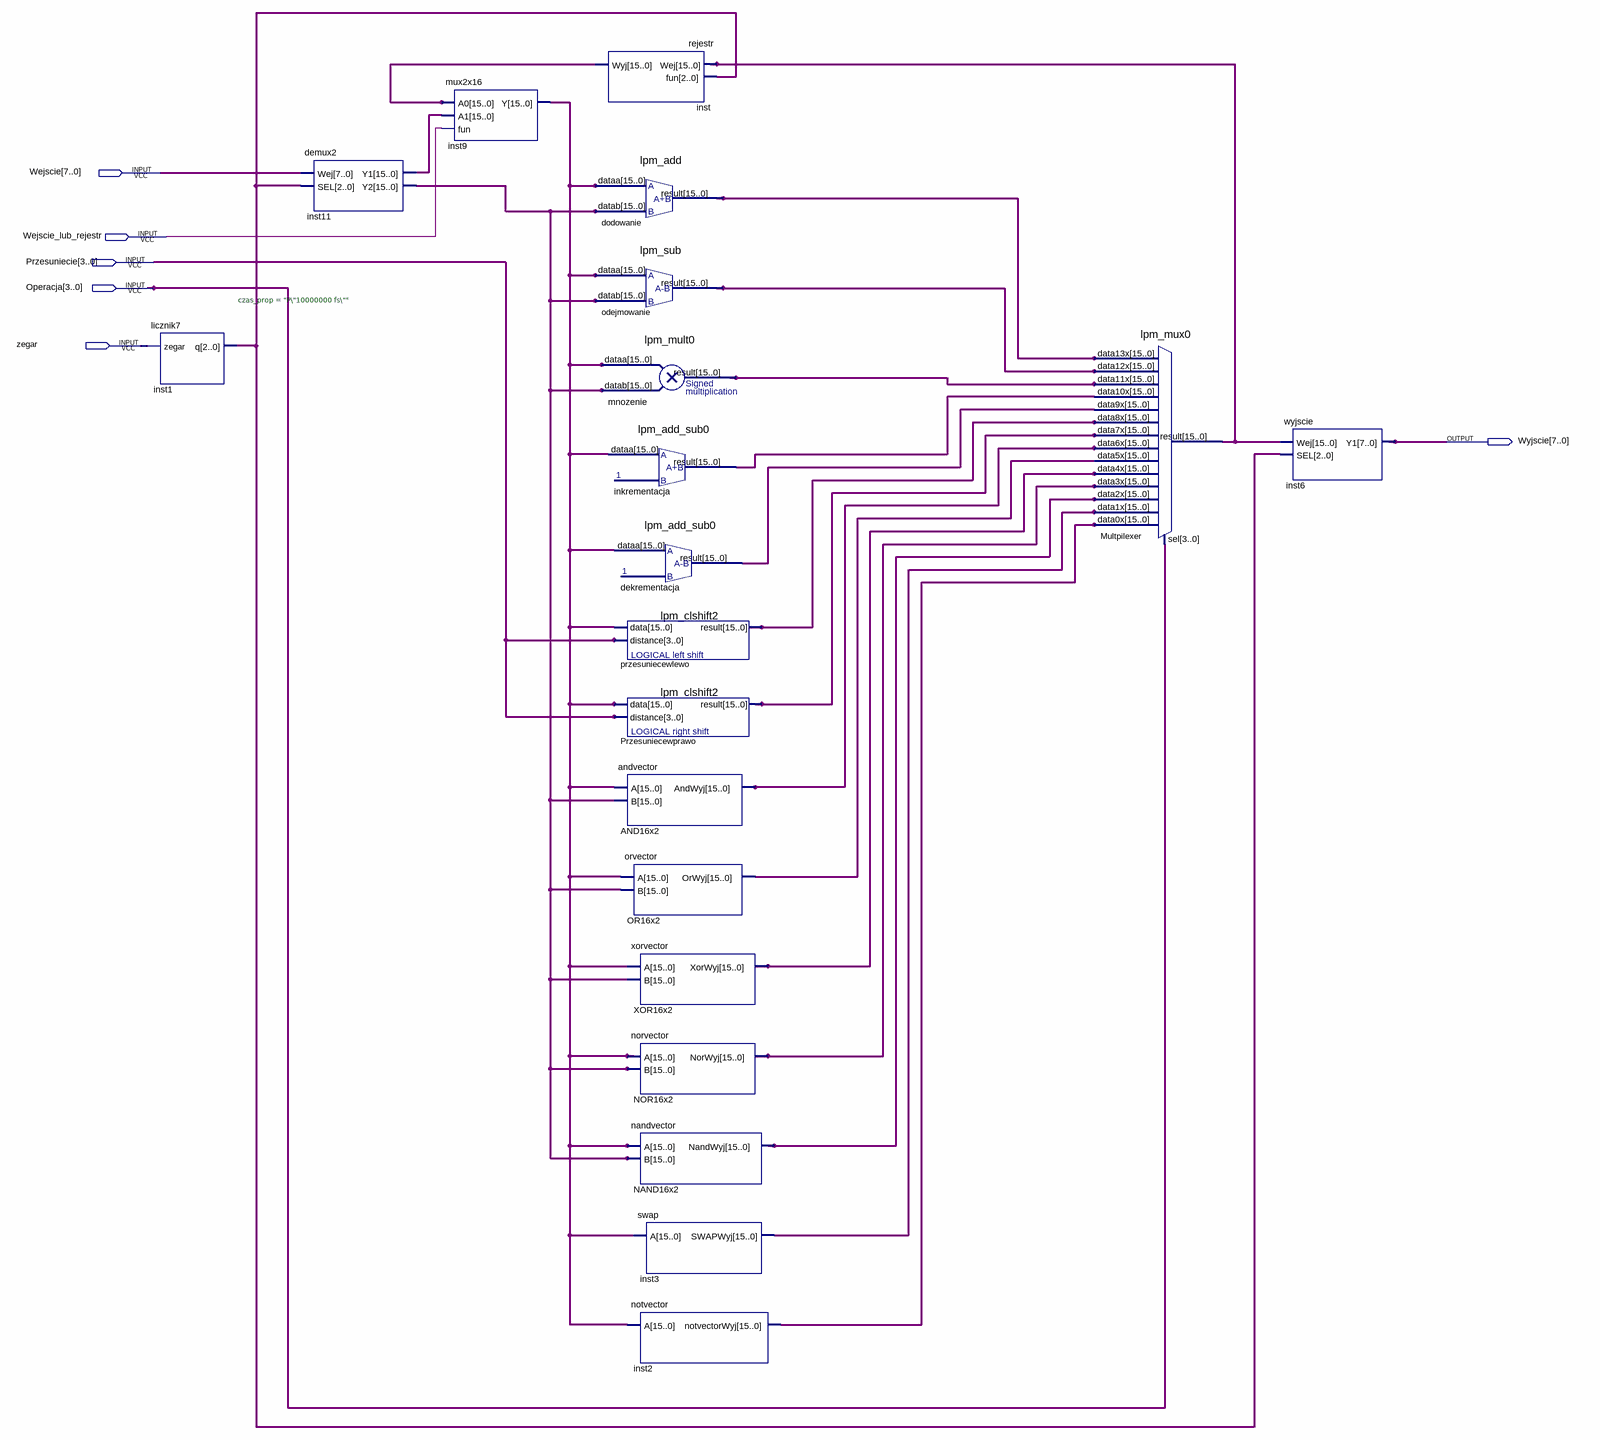
[diagram p0: schematic sheet]
// Quartus schematic arytrometr.bdf as structural Verilog: 20 symbols, 6 pins
module arytrometr (
  input  [7:0] Wejscie,
  input  Wejscie_lub_rejestr,
  input  [3:0] Przesuniecie,
  input  [3:0] Operacja,
  input  zegar,
  output [7:0] Wyjscie
);

  wire [2:0] inst1_q;
  wire [15:0] AND16x2_andwyj, dekrementacja_result, dodowanie_result, inkrementacja_result,
       inst2_notvectorwyj, inst3_swapwyj, inst9_y, inst11_y1, inst11_y2, inst_wyj, mnozenie_result,
       Multpilexer_result, NAND16x2_nandwyj, NOR16x2_norwyj, odejmowanie_result, OR16x2_orwyj,
       przesuniecewlewo_result, Przesuniecewprawo_result, XOR16x2_xorwyj;

  licznik7 #(.czas_prop("P\"10000000 fs\"")) inst1 (.zegar(zegar), .q(inst1_q));
  demux2 inst11 (.Wej(Wejscie), .SEL(inst1_q), .Y1(inst11_y1), .Y2(inst11_y2));
  mux2x16 inst9 (.A0(inst_wyj), .A1(inst11_y1), .fun(Wejscie_lub_rejestr), .Y(inst9_y));
  rejestr inst (.Wej(Multpilexer_result), .fun(inst1_q), .Wyj(inst_wyj));
  lpm_add dodowanie (.dataa(inst9_y), .datab(inst11_y2), .result(dodowanie_result));
  lpm_sub odejmowanie (.dataa(inst9_y), .datab(inst11_y2), .result(odejmowanie_result));
  lpm_mult0 mnozenie (.dataa(inst9_y), .datab(inst11_y2), .result(mnozenie_result));
  lpm_add_sub0 inkrementacja (.dataa(inst9_y), .result(inkrementacja_result));
  lpm_add_sub0 dekrementacja (.dataa(inst9_y), .result(dekrementacja_result));
  lpm_clshift2 przesuniecewlewo (.data(inst9_y), .distance(Przesuniecie), .result(przesuniecewlewo_result));
  lpm_clshift2 Przesuniecewprawo (.data(inst9_y), .distance(Przesuniecie), .result(Przesuniecewprawo_result));
  andvector AND16x2 (.A(inst9_y), .B(inst11_y2), .AndWyj(AND16x2_andwyj));
  orvector OR16x2 (.A(inst9_y), .B(inst11_y2), .OrWyj(OR16x2_orwyj));
  xorvector XOR16x2 (.A(inst9_y), .B(inst11_y2), .XorWyj(XOR16x2_xorwyj));
  norvector NOR16x2 (.A(inst9_y), .B(inst11_y2), .NorWyj(NOR16x2_norwyj));
  nandvector NAND16x2 (.A(inst9_y), .B(inst11_y2), .NandWyj(NAND16x2_nandwyj));
  swap inst3 (.A(inst9_y), .SWAPWyj(inst3_swapwyj));
  notvector inst2 (.A(inst9_y), .notvectorWyj(inst2_notvectorwyj));
  lpm_mux0 Multpilexer (
    .data13x(dodowanie_result), .data12x(odejmowanie_result), .data11x(mnozenie_result),
    .data10x(inkrementacja_result), .data9x(dekrementacja_result), .data8x(przesuniecewlewo_result),
    .data7x(Przesuniecewprawo_result), .data6x(AND16x2_andwyj), .data5x(OR16x2_orwyj),
    .data4x(XOR16x2_xorwyj), .data3x(NOR16x2_norwyj), .data2x(NAND16x2_nandwyj), .data1x(inst3_swapwyj),
    .data0x(inst2_notvectorwyj), .sel(Operacja), .result(Multpilexer_result));
  wyjscie inst6 (.Wej(Multpilexer_result), .SEL(inst1_q), .Y1(Wyjscie));
endmodule
